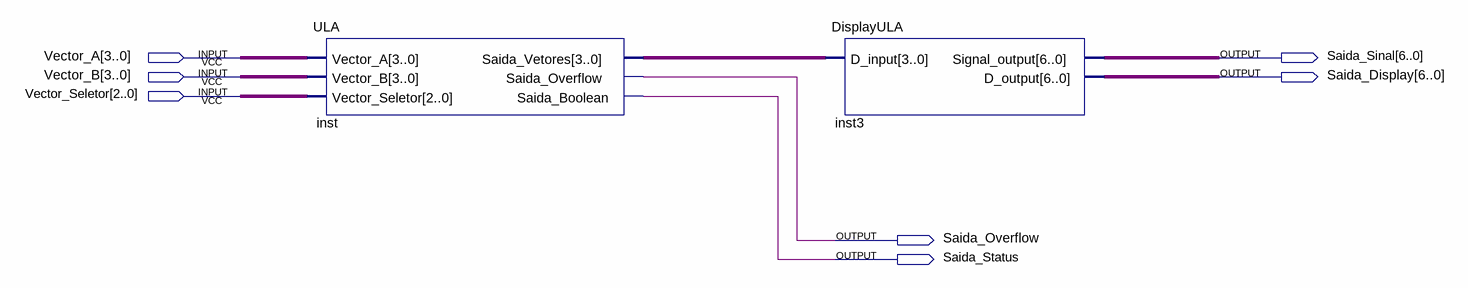
[diagram p0: schematic sheet]
// Quartus schematic ULAcDisplay.bdf as structural Verilog: 2 symbols, 7 pins
module ULAcDisplay (
  input  [3:0] Vector_A,
  input  [3:0] Vector_B,
  input  [2:0] Vector_Seletor,
  output [6:0] Saida_Sinal,
  output [6:0] Saida_Display,
  output Saida_Overflow,
  output Saida_Status
);

  wire [3:0] inst_saida_vetores;

  ULA inst (
    .Vector_A(Vector_A), .Vector_B(Vector_B), .Vector_Seletor(Vector_Seletor),
    .Saida_Vetores(inst_saida_vetores), .Saida_Overflow(Saida_Overflow), .Saida_Boolean(Saida_Status));
  DisplayULA inst3 (.D_input(inst_saida_vetores), .Signal_output(Saida_Sinal), .D_output(Saida_Display));
endmodule
